# Altium schematic sheet Sheet1.SchDoc
size A4; SheetNumber: 1; SheetTotal: 1
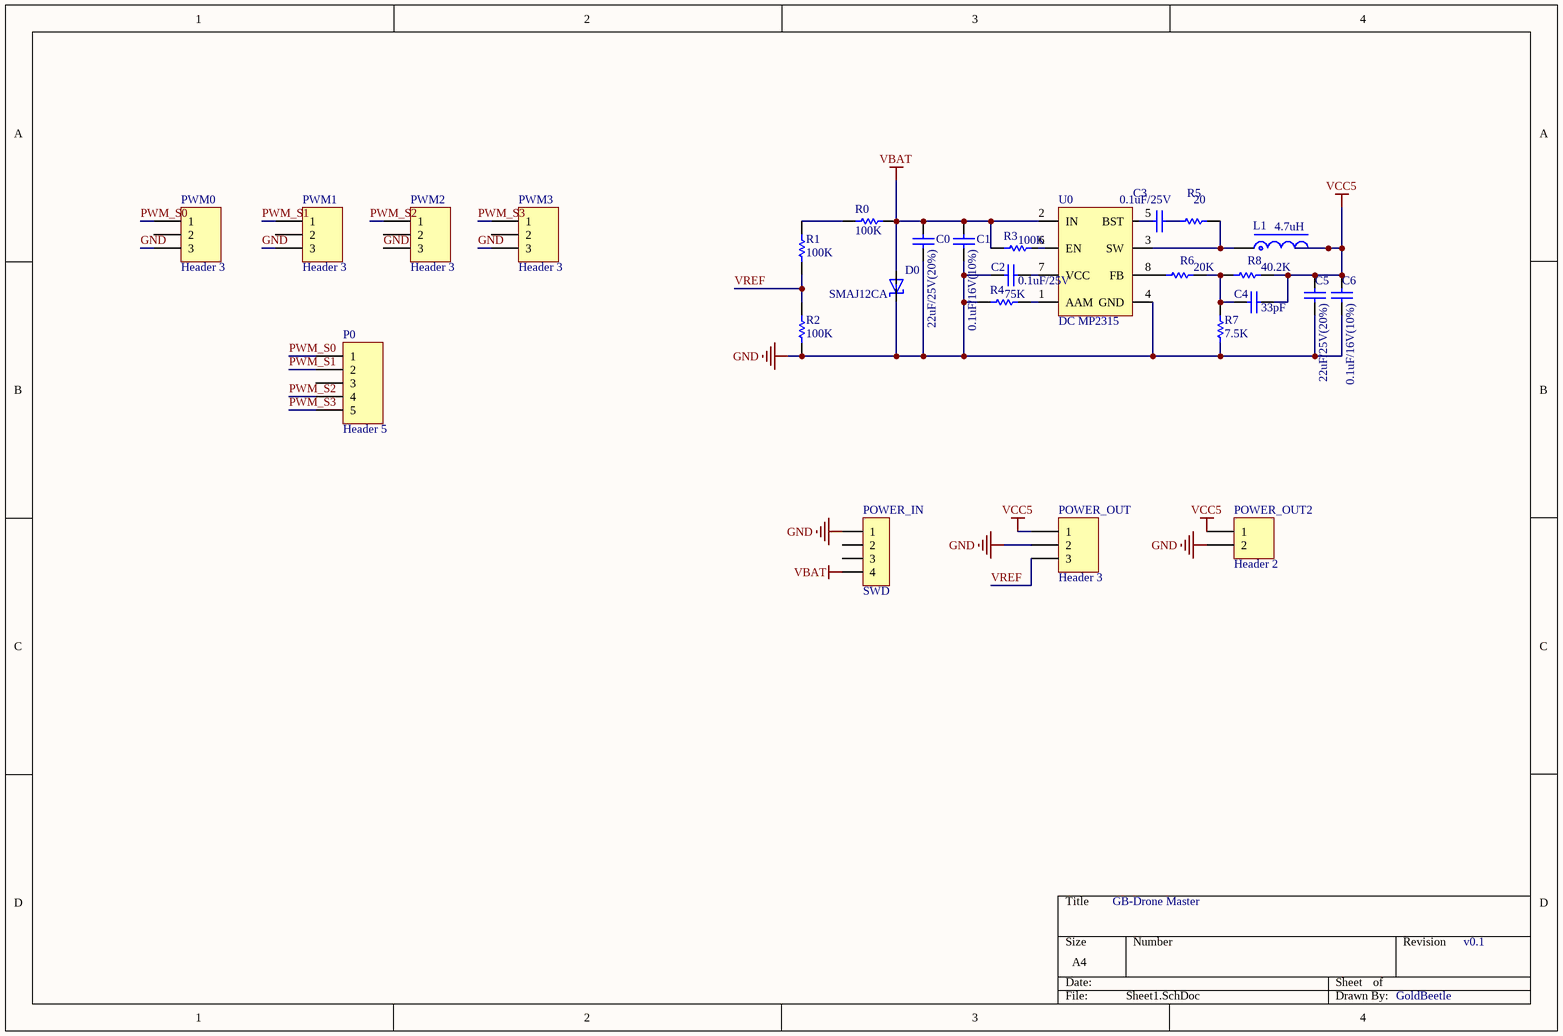
[diagram p0: Sheet1.SchDoc]

## Parts
C0  22uF/25V(20%)  [C0805]
C1  0.1uF/16V(10%)  [C0805]
C2  0.1uF/25V  [C0805]
C3  0.1uF/25V  [C0805]
C4  33pF  [C0805]
C5  22uF/25V(20%)  [C0805]
C6  0.1uF/16V(10%)  [C0805]
D0  SMAJ12CA  [DO-214AC]
L1  4.7uH  [INDC6060X300]
P0  Header 5  [XH2.54-5P]
POWER_IN  SWD  [XH2.54-4P]
POWER_OUT  Header 3  [XH2.54-3P]
POWER_OUT2  Header 2  [XH2.54-2P]
PWM0  Header 3  [XH2.54-3P]
PWM1  Header 3  [XH2.54-3P]
PWM2  Header 3  [XH2.54-3P]
PWM3  Header 3  [XH2.54-3P]
R0  100K  [C0805]
R1  100K  [C0805]
R2  100K  [C0805]
R3  100K  [C0805]
R4  75K  [C0805]
R5  20  [C0805]
R6  20K  [C0805]
R7  7.5K  [C0805]
R8  40.2K  [C0805]
U0  DC MP2315  [SOT23-8L]

## Nets
GND: C0.1 C1.1 C2.1 C5.1 C6.1 D0.C POWER_IN.1 POWER_OUT.2 POWER_OUT2.2 PWM0.3 PWM1.3 PWM2.3 PWM3.3 R2.1 R4.1 R7.2 U0.4(GND)
VBAT: C0.2 C1.2 D0.A POWER_IN.4 R0.1 R3.1 U0.2(IN)
VCC5: C4.2 C5.2 C6.2 L1.2 POWER_OUT.1 POWER_OUT2.1 R8.2
PWM_S0: P0.1 PWM0.1
PWM_S1: P0.2 PWM1.1
PWM_S2: P0.4 PWM2.1
PWM_S3: P0.5 PWM3.1
VREF: POWER_OUT.3 R1.2 R2.2
NetC2_2: C2.2 U0.7(VCC)
NetC3_1: C3.1 U0.5(BST)
NetC3_2: C3.2 R5.1
NetC4_1: C4.1 R6.2 R7.1 R8.1
NetL1_1: L1.1 R5.2 U0.3(SW)
NetR0_2: R0.2 R1.1
NetR3_2: R3.2 U0.6(EN)
NetR4_2: R4.2 U0.1(AAM)
NetR6_1: R6.1 U0.8(FB)

Not connected (* = marked no-connect by the designer): P0 3; POWER_IN 2 3; PWM0 2; PWM1 2; PWM2 2; PWM3 2

## Notes on the sheet
- GB-Drone Master
- v0.1
- GoldBeetle

## Library data of the parts
C0-C6 = Cap: Capacitor; Published: 8-Jun-2000; LatestRevisionDate: 17-Jul-2002; LatestRevisionNote: Re-released for DXP Platform.; PackageReference: RAD-0.3; Publisher: Altium Limited; PackageDescription: Radial Cap, Thru-Hole; 2 Leads; 0.3 in Pin Spacing
D0 = SMAJ12CA: 19.9V Clamp 20.1A Ipp Tvs Diode Surface Mount SMAJ _DO-214AC_; MF: Taiwan Semiconductor; SnapEDA_Link: https://www.snapeda.com/parts/SMAJ12CA/Taiwan%20Semiconductor/view-part/2769109/?ref=snap; Availability: Unavailable; Value: *; MP: SMAJ12CA; Package: DO-214AC-214 Taiwan Semiconductor; Price: None
L1 = L-NR: NR功率电感; 版权归属: 源创客; BOM名称: NR功率电感; 学习资源: www.ooocke.com
P0 = Header 5: Header, 5-Pin; LatestRevisionDate: 17-Jul-2002; LatestRevisionNote: Re-released for DXP Platform.; Publisher: Altium Limited
POWER_IN = Header 4: 4P接插件; 版权归属: 源创客; BOM名称: 4P接插件; 学习资源: www.ooocke.com
POWER_OUT PWM0-PWM3 = Header 3: Header, 3-Pin; LatestRevisionDate: 17-Jul-2002; LatestRevisionNote: Re-released for DXP Platform.; Publisher: Altium Limited
POWER_OUT2 = Header 2: Header, 2-Pin; LatestRevisionDate: 17-Jul-2002; LatestRevisionNote: Re-released for DXP Platform.; Publisher: Altium Limited
R0-R8 = Res1: Resistor; Published: 8-Jun-2000; LatestRevisionDate: 17-Jul-2002; LatestRevisionNote: Re-released for DXP Platform.; PackageReference: AXIAL-0.3; Publisher: Altium Limited; PackageDescription: Axial Device, Thru-Hole; 2 Leads; 0.3 in Pin Spacing
U0 = DC MP2315: DC降压芯片